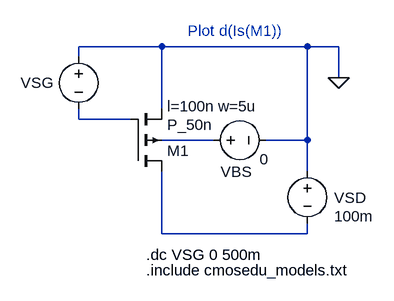
[diagram p0: schematic Fig9_33_PMOS.asc]
Fig9_33_PMOS.asc, the LTspice schematic file:
Version 4
SHEET 1 1184 688
WIRE 448 16 320 16
WIRE 672 16 448 16
WIRE 720 16 672 16
WIRE 320 32 320 16
WIRE 720 64 720 16
WIRE 448 112 448 16
WIRE 320 128 320 112
WIRE 400 128 320 128
WIRE 528 160 448 160
WIRE 672 160 672 16
WIRE 672 160 608 160
WIRE 672 208 672 160
WIRE 448 304 448 208
WIRE 672 304 672 288
WIRE 672 304 448 304
FLAG 720 64 0
SYMBOL voltage 320 16 R0
WINDOW 0 -89 56 Left 2
WINDOW 3 24 104 Invisible 2
WINDOW 123 0 0 Left 2
WINDOW 39 0 0 Left 2
SYMATTR InstName VSG
SYMATTR Value 0
SYMBOL voltage 672 192 R0
WINDOW 123 0 0 Left 2
WINDOW 39 0 0 Left 2
WINDOW 0 41 57 Left 2
WINDOW 3 41 85 Left 2
SYMATTR InstName VSD
SYMATTR Value 100m
SYMBOL voltage 512 160 M90
WINDOW 0 64 50 VBottom 2
WINDOW 3 45 93 VBottom 2
WINDOW 123 0 0 Left 2
WINDOW 39 0 0 Left 2
SYMATTR InstName VBS
SYMATTR Value 0
SYMBOL pmos4 400 208 M180
WINDOW 123 56 100 Left 2
SYMATTR Value2 l=100n w=5u
SYMATTR InstName M1
SYMATTR Value P_50n
TEXT 424 336 Left 2 !.dc VSG 0 500m
TEXT 424 360 Left 2 !.include cmosedu_models.txt
TEXT 488 -8 Left 2 ;Plot d(Is(M1))

The netlist it stands for:
* Fig9_33_PMOS.asc
VSG 0 N001 0
VSD 0 N003 100m
VBS N002 0 0
M1 N003 N001 0 N002 P_50n l=100n w=5u
.model NMOS NMOS
.model PMOS PMOS
.lib standard.mos
.dc VSG 0 500m
.include cmosedu_models.txt
* Plot d(Is(M1))
.backanno
.end